# EAGLE schematic NMPaviIMU (EAGLE 9.6.2)

## Sheet 1 of 2
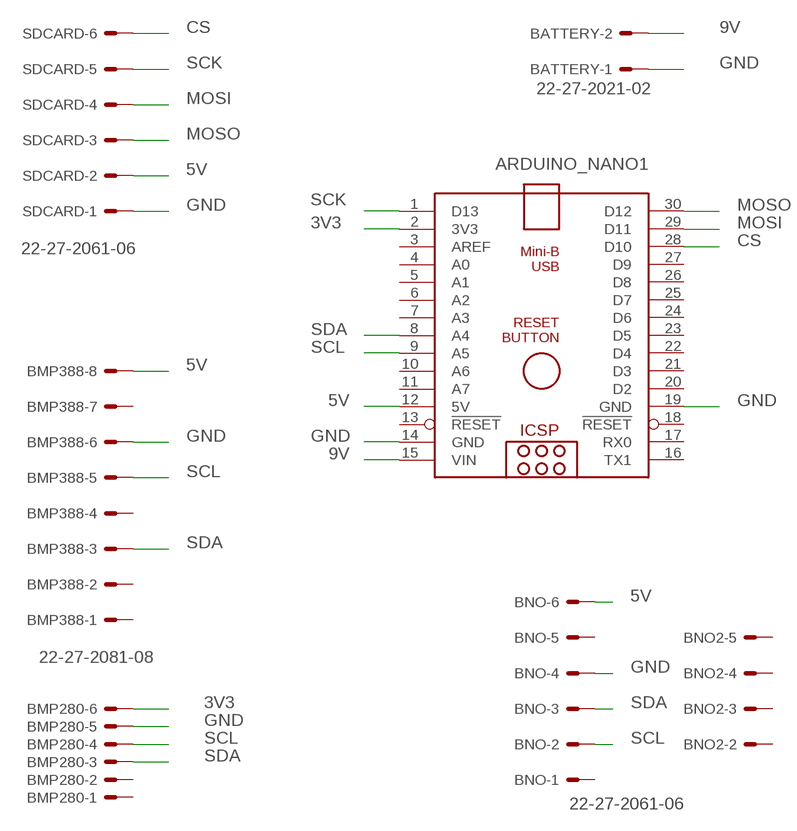
[diagram p0: schematic, sheet 1]

### Parts
ARDUINO_NANO1  ARDUINO_NANO  [ARDUINO_NANO]
BATTERY  22-27-2021-02  [6410-02]
BMP280  22-23-2061  [22-23-2061]
BMP388  22-27-2081-08  [6410-08]
BNO  22-27-2061-06  [6410-06]
BNO2  22-27-2061-06  [6410-06]
SDCARD  22-27-2061-06  [6410-06]

### Nets
3V3: ARDUINO_NANO1.2(3V3) BMP280.6
5V: ARDUINO_NANO1.12(5V) BMP388.8 BNO.6 SDCARD.2
9V: ARDUINO_NANO1.15(VIN) BATTERY.2
CS: ARDUINO_NANO1.28(D10) SDCARD.6
GND: ARDUINO_NANO1.14(GND) ARDUINO_NANO1.19(GND) BATTERY.1 BMP280.5 BMP388.6 BNO.4 SDCARD.1
MOSI: ARDUINO_NANO1.29(D11) SDCARD.4
MOSO: ARDUINO_NANO1.30(D12) SDCARD.3
SCK: ARDUINO_NANO1.1(D13) SDCARD.5
SCL: ARDUINO_NANO1.9(A5) BMP280.4 BMP388.5 BNO.2
SDA: ARDUINO_NANO1.8(A4) BMP280.3 BMP388.3 BNO.3
Unconnected: ARDUINO_NANO1.3(AREF) ARDUINO_NANO1.4(A0) ARDUINO_NANO1.5(A1) ARDUINO_NANO1.6(A2) ARDUINO_NANO1.7(A3) ARDUINO_NANO1.10(A6) ARDUINO_NANO1.11(A7) ARDUINO_NANO1.13(!RESET) ARDUINO_NANO1.16(TX1) ARDUINO_NANO1.17(RX0) ARDUINO_NANO1.18(!RESET) ARDUINO_NANO1.20(D2) ARDUINO_NANO1.21(D3) ARDUINO_NANO1.22(D4) ARDUINO_NANO1.23(D5) ARDUINO_NANO1.24(D6) ARDUINO_NANO1.25(D7) ARDUINO_NANO1.26(D8) ARDUINO_NANO1.27(D9) BMP280.1 BMP280.2 BMP388.1 BMP388.2 BMP388.4 BMP388.7 BNO2.1 BNO2.2 BNO2.3 BNO2.4 BNO2.5 BNO2.6 BNO.1 BNO.5

## Sheet 2 of 2

## Library data of the parts
ARDUINO_NANO1 = ArduinoNanoV30:ARDUINO_NANO: Arduino Nano V3.0 Overview: The Arduino Nano is a small, complete, and breadboard-friendly board based on the ATmega328 (Arduino Nano 3.x) or ATmega168 (Arduino Nano 2.x). It has more or less the same functionality of the Arduino Duemilanove, but in a different package. It lacks only a DC power jack, and works with a Mini-B USB cable instead of a standard one. The Nano was designed and is being produced by Gravitech. Specifications: Microcontroller Atmel ATmega168 or ATmega328 Operating Voltage (logic level) 5 V Input Voltage (recommended) 7-12 V Input Voltage (limits) 6-20 V Digital I/O Pins 14 (of which 6 provide PWM output) Analog Input Pins 8 DC Current per I/O Pin 40 mA Flash Memory 16 KB (ATmega168) or 32 KB (ATmega328) of which 2 KB used by bootloader SRAM 1 KB (ATmega168) or 2 KB (ATmega328) EEPROM 512 bytes (ATmega168) or 1 KB (ATmega328) Clock Speed 16 MHz Dimensions 0.73" x 1.70" Length 45 mm Width 18 mm Weigth 5 g Power: The Arduino Nano can be powered via the Mini-B USB connection, 6-20V unregulated external power supply (pin 30), or 5V regulated external power supply (pin 27). The power source is automatically selected to the highest voltage source. Memory: The ATmega168 has 16 KB of flash memory for storing code (of which 2 KB is used for the bootloader); the ATmega328 has 32 KB, (also with 2 KB used for the bootloader). The ATmega168 has 1 KB of SRAM and 512 bytes of EEPROM (which can be read and written with the EEPROM library); the ATmega328 has 2 KB of SRAM and 1 KB of EEPROM. Input and Output: Each of the 14 digital pins on the Nano can be used as an input or output, using pinMode(), digitalWrite(), and digitalRead() functions. They operate at 5 volts. Each pin can provide or receive a maximum of 40 mA and has an internal pull-up resistor (disconnected by default) of 20-50 kOhms. In addition, some pins have specialized functions. Visit Arduino - ArduinoBoardNano <https://www.arduino.cc/en/Main/ArduinoBoardNano>
BATTERY = con-molex:22-?-02: CONNECTOR wire to board 2.54 mm (.1 inch) pitch header; MF: MOLEX; OC_FARNELL: unknown; OC_NEWARK: unknown
BMP280 = con-molex@1:22-23-2061: .100" (2.54mm) Center Header - 6 Pin; MF: MOLEX; MPN: 22-23-2061; OC_FARNELL: 1462922; OC_NEWARK: 27C1933
BMP388 = con-molex:22-?-08: CONNECTOR wire to board 2.54 mm (.1 inch) pitch header; MF: MOLEX; OC_FARNELL: unknown; OC_NEWARK: unknown
BNO BNO2 SDCARD = con-molex:22-?-06: CONNECTOR wire to board 2.54 mm (.1 inch) pitch header; MF: MOLEX; OC_FARNELL: unknown; OC_NEWARK: unknown